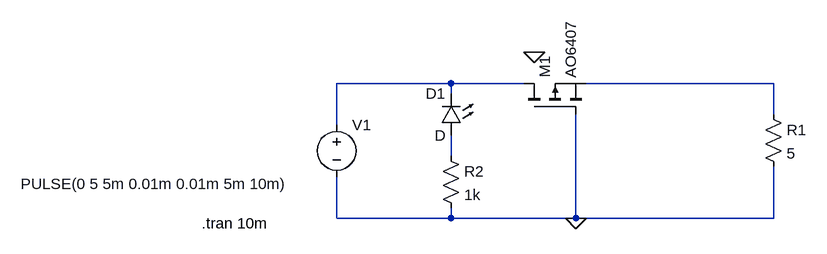
[diagram p0: schematic rev-pol.asc]
rev-pol.asc, the LTspice schematic file:
Version 4
SHEET 1 880 680
WIRE 32 112 -144 112
WIRE 144 112 32 112
WIRE 528 112 240 112
WIRE 32 128 32 112
WIRE 528 160 528 112
WIRE -144 176 -144 112
WIRE 32 224 32 192
WIRE -144 320 -144 256
WIRE 32 320 32 304
WIRE 32 320 -144 320
WIRE 224 320 224 160
WIRE 224 320 32 320
WIRE 528 320 528 240
WIRE 528 320 224 320
FLAG 224 320 0
FLAG 160 64 0
SYMBOL pmos 144 160 R270
SYMATTR InstName M1
SYMATTR Value AO6407
SYMBOL voltage -144 160 R0
WINDOW 3 -486 107 Left 2
WINDOW 123 0 0 Left 0
WINDOW 39 0 0 Left 0
SYMATTR Value PULSE(0 5 5m 0.01m 0.01m 5m 10m)
SYMATTR InstName V1
SYMBOL res 512 144 R0
SYMATTR InstName R1
SYMATTR Value 5
SYMBOL res 16 208 R0
SYMATTR InstName R2
SYMATTR Value 1k
SYMBOL LED 48 192 R180
WINDOW 0 24 64 Left 2
WINDOW 3 24 0 Left 2
SYMATTR InstName D1
TEXT -352 328 Left 2 !.tran 10m

The netlist it stands for:
* rev-pol.asc
M1 N001 0 N002 N002 AO6407
V1 N001 0 PULSE(0 5 5m 0.01m 0.01m 5m 10m)
R1 N002 0 5
R2 N003 0 1k
D1 N003 N001 D
.model D D
.lib standard.dio
.model NMOS NMOS
.model PMOS PMOS
.lib standard.mos
.tran 10m
.backanno
.end